# Altium project PMOD_Step.PrjPcb
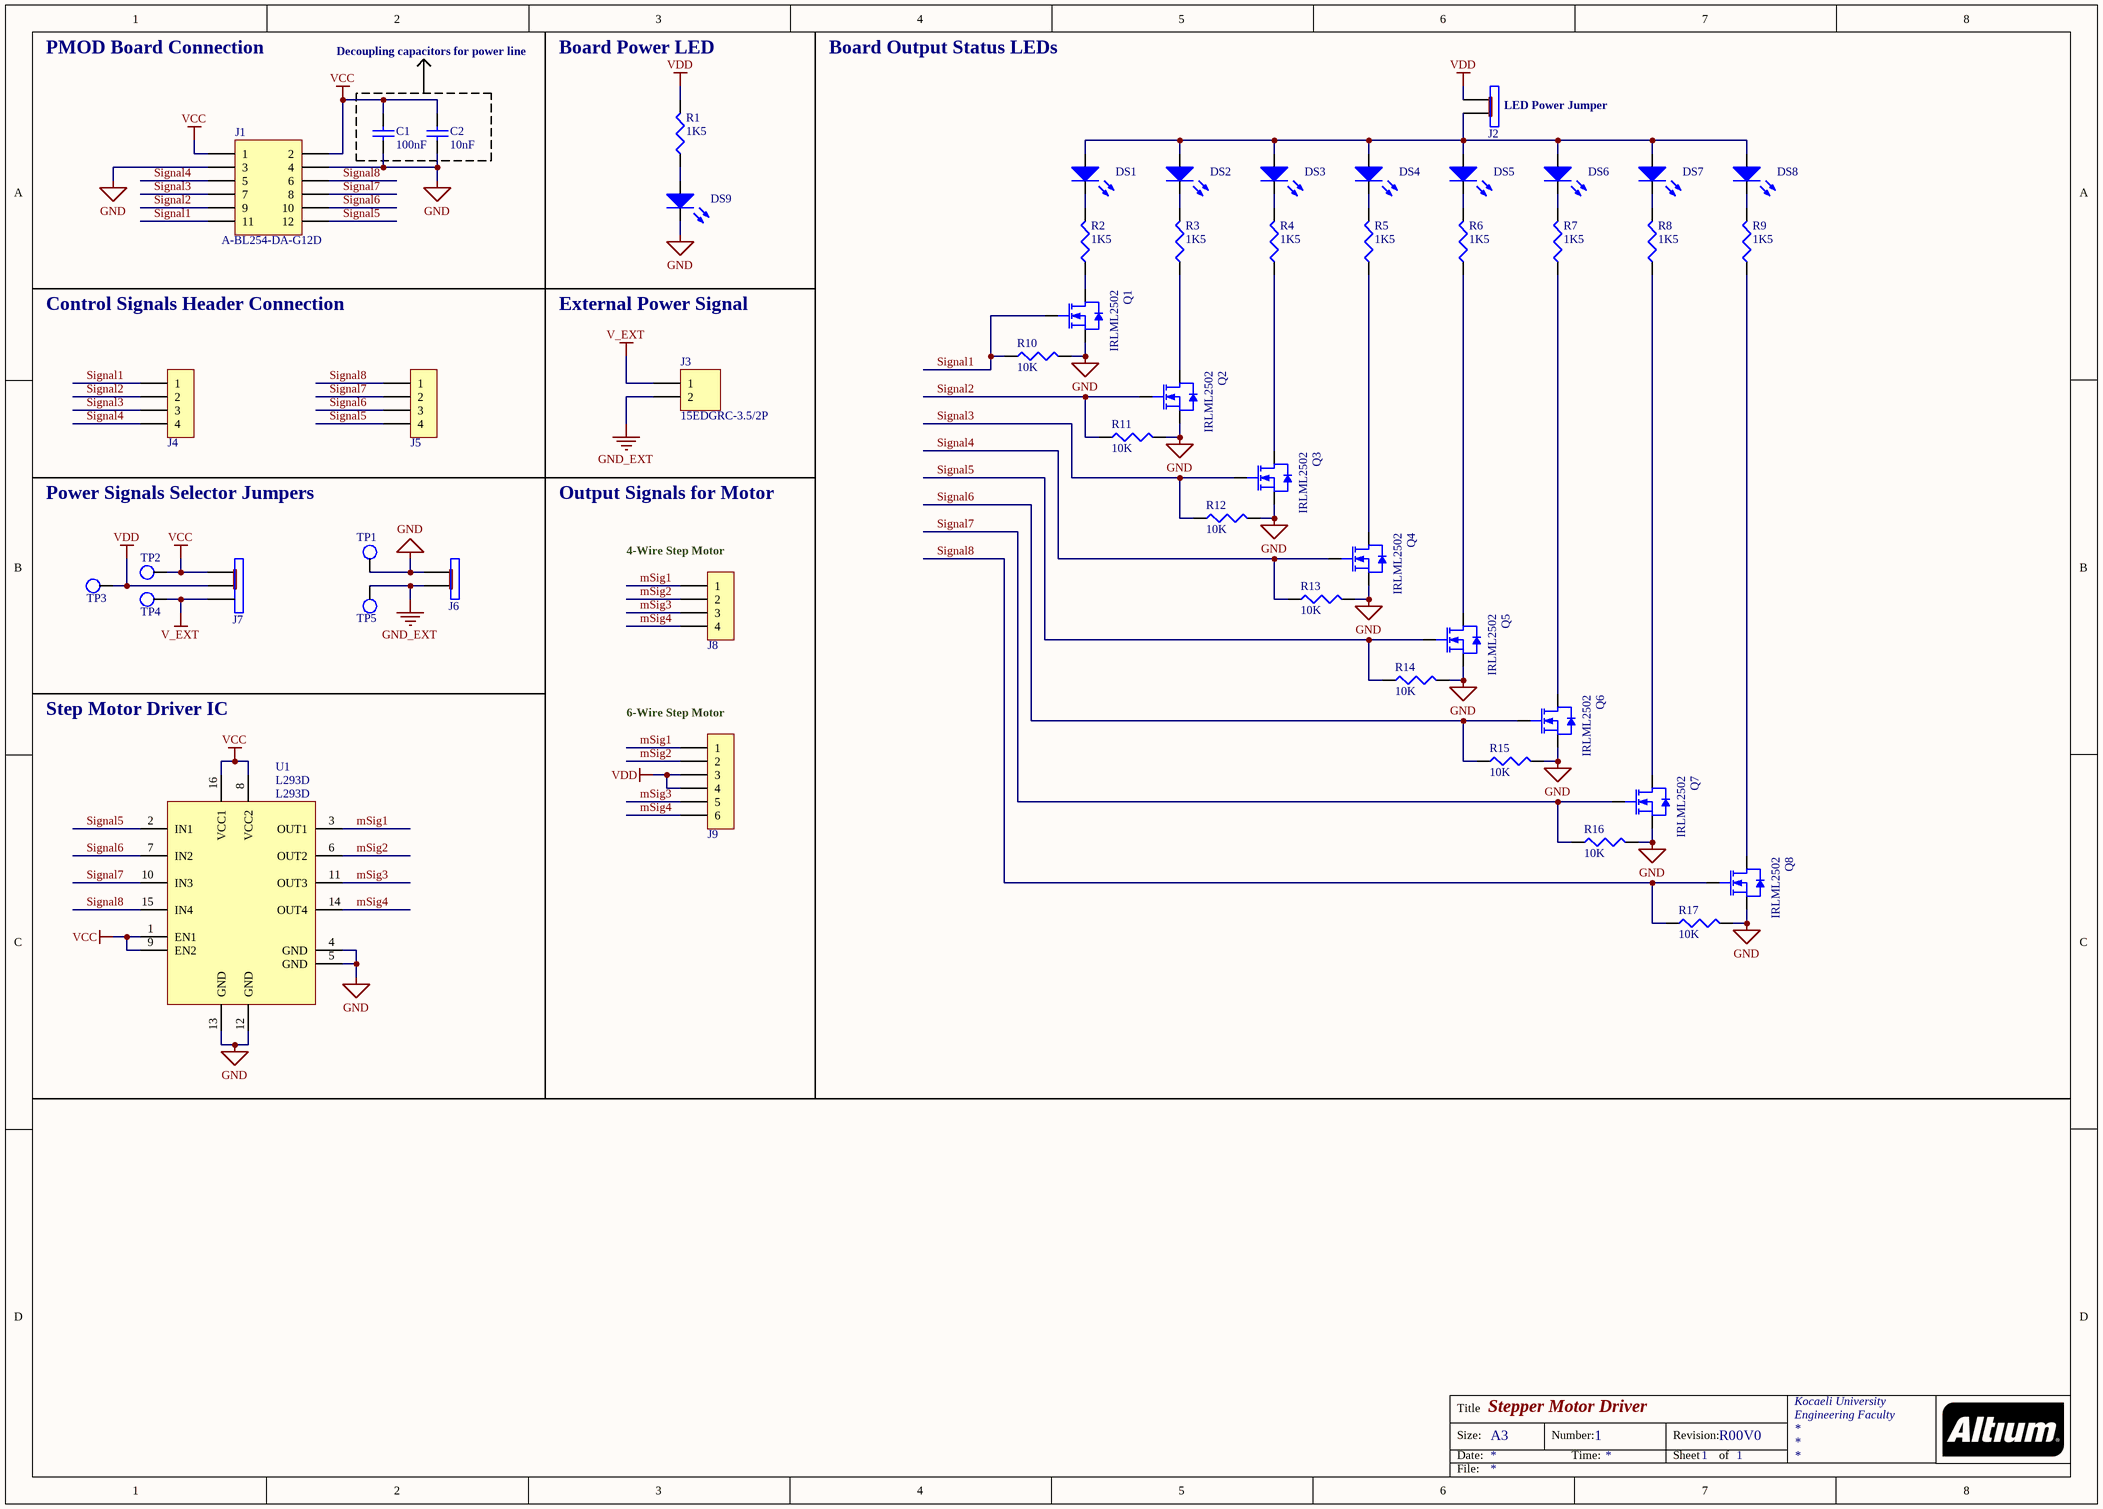
[diagram p0: [01] - Stepper Motor Driver.SchDoc]
RevNo_Sheet: R00V0; RevNo: R00V00
1 sheet, 51 parts. Net scope: global (net labels, ports and power ports of the same name join across sheets).
Board file: PMOD_Step.PcbDoc

## Sheet [01] - Stepper Motor Driver.SchDoc: Stepper Motor Driver
size A3; DrawnBy: Busra Topal; Engineer: Busra Topal; Organization: Kocaeli University; Address1: Engineering Faculty; DocumentNumber: 1; Revision: R00V0; SheetNumber: 1; SheetTotal: 1

### Parts
C1  value 100nF  [CAP-0603]  (hidden comment: CL10B104KB8NNNC)
C2  value 10nF  [CAP-0603]  (hidden comment: CL10B103KB8NNNC)
DS1  SMD Green Led  [LED_SMD_0603G]  (value not drawn)
DS2  SMD Green Led  [LED_SMD_0603G]  (value not drawn)
DS3  SMD Green Led  [LED_SMD_0603G]  (value not drawn)
DS4  SMD Green Led  [LED_SMD_0603G]  (value not drawn)
DS5  SMD Green Led  [LED_SMD_0603G]  (value not drawn)
DS6  SMD Green Led  [LED_SMD_0603G]  (value not drawn)
DS7  SMD Green Led  [LED_SMD_0603G]  (value not drawn)
DS8  SMD Green Led  [LED_SMD_0603G]  (value not drawn)
DS9  SMD Green Led  [LED_SMD_0603G]  (value not drawn)
J1  A-BL254-DA-G12D  [CON-PMOD-FEMALE-2X6]
J2  2.54mm-Jumper  [CON-JUMPER-2.54-2L]  (value not drawn)
J3  15EDGRC-3.5/2P  [15EDGRC-3.5-2]
J4  2.54mm-STD-M-1x4  [CON-HDR-M-2.54-1x4]  (value not drawn)
J5  2.54mm-STD-M-1x4  [CON-HDR-M-2.54-1x4]  (value not drawn)
J6  2.54mm-Jumper  [CON-JUMPER-2.54-2L]  (value not drawn)
J7  2.54mm-Jumper  [CON-JUMPER-2.54-3L]  (value not drawn)
J8  L-KLS1-XL5-2.50-04-R1  [CON-JST-XH-2.50-4PIN]  (value not drawn)
J9  L-KLS1-XL5-2.50-06-R1  [CON-JST-XH-2.50-6PIN]  (value not drawn)
Q1  value IRLML2502  [SOT23_L]  (hidden comment: 2N7002K)
Q2  value IRLML2502  [SOT23_L]  (hidden comment: 2N7002K)
Q3  value IRLML2502  [SOT23_L]  (hidden comment: 2N7002K)
Q4  value IRLML2502  [SOT23_L]  (hidden comment: 2N7002K)
Q5  value IRLML2502  [SOT23_L]  (hidden comment: 2N7002K)
Q6  value IRLML2502  [SOT23_L]  (hidden comment: 2N7002K)
Q7  value IRLML2502  [SOT23_L]  (hidden comment: 2N7002K)
Q8  value IRLML2502  [SOT23_L]  (hidden comment: 2N7002K)
R1  value 1K5  [RES-0603]  (hidden comment: RC0603FR-131K5L)
R2  value 1K5  [RES-0603]  (hidden comment: RC0603FR-131K5L)
R3  value 1K5  [RES-0603]  (hidden comment: RC0603FR-131K5L)
R4  value 1K5  [RES-0603]  (hidden comment: RC0603FR-131K5L)
R5  value 1K5  [RES-0603]  (hidden comment: RC0603FR-131K5L)
R6  value 1K5  [RES-0603]  (hidden comment: RC0603FR-131K5L)
R7  value 1K5  [RES-0603]  (hidden comment: RC0603FR-131K5L)
R8  value 1K5  [RES-0603]  (hidden comment: RC0603FR-131K5L)
R9  value 1K5  [RES-0603]  (hidden comment: RC0603FR-131K5L)
R10  value 10K  [RES-0603]  (hidden comment: RC0603FR-1310KL)
R11  value 10K  [RES-0603]  (hidden comment: RC0603FR-1310KL)
R12  value 10K  [RES-0603]  (hidden comment: RC0603FR-1310KL)
R13  value 10K  [RES-0603]  (hidden comment: RC0603FR-1310KL)
R14  value 10K  [RES-0603]  (hidden comment: RC0603FR-1310KL)
R15  value 10K  [RES-0603]  (hidden comment: RC0603FR-1310KL)
R16  value 10K  [RES-0603]  (hidden comment: RC0603FR-1310KL)
R17  value 10K  [RES-0603]  (hidden comment: RC0603FR-1310KL)
TP1  TP  [TP_TH]  (value not drawn)
TP2  TP  [TP_TH]  (value not drawn)
TP3  TP  [TP_TH]  (value not drawn)
TP4  TP  [TP_TH]  (value not drawn)
TP5  TP  [TP_TH]  (value not drawn)
U1  L293D  [PDIP-16]

### Nets
GND: C1.1 C2.1 DS9.2(K) J1.3 J1.4 J6.1 Q1.2(S) Q2.2(S) Q3.2(S) Q4.2(S) Q5.2(S) Q6.2(S) Q7.2(S) Q8.2(S) R10.2 R11.2 R12.2 R13.2 R14.2 R15.2 R16.2 R17.2 TP1.0 U1.4(GND) U1.5(GND) U1.12(GND) U1.13(GND)
GND_EXT: J3.2 J6.2 TP5.0
V_EXT: J3.1 J7.3 TP4.0
VCC: C1.2 C2.2 J1.1 J1.2 J7.1 TP2.0 U1.1(EN1) U1.8(VCC2) U1.9(EN2) U1.16(VCC1)
VDD: J2.1 J7.2 J9.3 J9.4 R1.2 TP3.0
mSig1: J8.1 J9.1 U1.3(OUT1)
mSig2: J8.2 J9.2 U1.6(OUT2)
mSig3: J8.3 J9.5 U1.11(OUT3)
mSig4: J8.4 J9.6 U1.14(OUT4)
Signal1: J1.11 J4.1 Q1.1(G) R10.1
Signal2: J1.9 J4.2 Q2.1(G) R11.1
Signal3: J1.7 J4.3 Q3.1(G) R12.1
Signal4: J1.5 J4.4 Q4.1(G) R13.1
Signal5: J1.12 J5.4 Q5.1(G) R14.1 U1.2(IN1)
Signal6: J1.10 J5.3 Q6.1(G) R15.1 U1.7(IN2)
Signal7: J1.8 J5.2 Q7.1(G) R16.1 U1.10(IN3)
Signal8: J1.6 J5.1 Q8.1(G) R17.1 U1.15(IN4)
NetDS1_1: DS1.1(A) DS2.1(A) DS3.1(A) DS4.1(A) DS5.1(A) DS6.1(A) DS7.1(A) DS8.1(A) J2.2
NetDS1_2: DS1.2(K) R2.2
NetDS2_2: DS2.2(K) R3.2
NetDS3_2: DS3.2(K) R4.2
NetDS4_2: DS4.2(K) R5.2
NetDS5_2: DS5.2(K) R6.2
NetDS6_2: DS6.2(K) R7.2
NetDS7_2: DS7.2(K) R8.2
NetDS8_2: DS8.2(K) R9.2
NetDS9_1: DS9.1(A) R1.1
NetQ1_3: Q1.3(D) R2.1
NetQ2_3: Q2.3(D) R3.1
NetQ3_3: Q3.3(D) R4.1
NetQ4_3: Q4.3(D) R5.1
NetQ5_3: Q5.3(D) R6.1
NetQ6_3: Q6.3(D) R7.1
NetQ7_3: Q7.3(D) R8.1
NetQ8_3: Q8.3(D) R9.1

### Notes on the sheet
- PMOD Board Connection
- Decoupling capacitors for power line
- Board Power LED
- Board Output Status LEDs
- (near J2) LED Power Jumper
- Control Signals Header Connection
- External Power Signal
- Power Signals Selector Jumpers
- Output Signals for Motor
- (near J8) 4-Wire Step Motor
- Step Motor Driver IC
- (near J9) 6-Wire Step Motor
- Title
- Size:
- Date:
- A3
- Number:
- Time:
- Revision:
- Sheet
- of
- File:

### Library data of the parts
C1 = CAP-100N-0603: CAP CER 0.1UF 50V 10% X7R 0603; Manufacturer: Samsung Electro-Mechanics America, Inc; Capacitance: 0.1µF; Supplier 1: Digi-Key; Manufacturer Part Number: CL10B104KB8NNNC; RoHS: RoHS Compliant; Category: Capacitors; Stock 1: 9364000; Pricing 1: 4000=0.00513, 8000=0.00468, 12000=0.00446, 28000=0.00424, 100000=0.00307 (USD); Packaging: Tape & Reel (TR); Tolerance: ±10%; Voltage - Rated: 50V; Temperature Coefficient: X7R; Mounting Type: Surface Mount, MLCC; Operating Temperature: -55°C ~ 125°C; Applications: General Purpose; Ratings: -; Package / Case: 0603 (1608 Metric); Size / Dimension: 0.063" L x 0.031" W (1.60mm x 0.80mm); Height - Seated (Max): -; Thickness (Max): 0.035" (0.90mm); Lead Spacing: -; Features: -; Lead Style: -; ComponentLink1URL: http://www.samsungsem.com/servlet/FileDownload?type=spec&file=CL10B104KB8NNNC.pdf; ComponentLink1Description: http://www.samsungsem.com/servlet/FileDownload?type=spec&file=CL10B104KB8NNNC.pdf; Supplier Part Number 1: 1276-1000-2-ND
C2 = CAP-10N-0603: CAP CER 10000PF 50V 10% X7R 0603; Manufacturer: Samsung Electro-Mechanics America, Inc; Supplier 1: Digi-Key; Manufacturer Part Number: CL10B103KB8NNNC; RoHS: RoHS Compliant; Category: Capacitors; Stock 1: 504000; Pricing 1: 4000=0.00345, 8000=0.00315, 12000=0.003, 28000=0.00285, 100000=0.00206 (USD); Packaging: Tape & Reel (TR); Capacitance: 10000pF; Tolerance: ±10%; Voltage - Rated: 50V; Temperature Coefficient: X7R; Mounting Type: Surface Mount, MLCC; Operating Temperature: -55°C ~ 125°C; Applications: General Purpose; Ratings: -; Package / Case: 0603 (1608 Metric); Size / Dimension: 0.063" L x 0.031" W (1.60mm x 0.80mm); Height - Seated (Max): -; Thickness (Max): 0.035" (0.90mm); Lead Spacing: -; Features: -; Lead Style: -; ComponentLink1URL: http://www.samsungsem.com/servlet/FileDownload?type=spec&file=CL10B103KB8NNNC.pdf; ComponentLink1Description: http://www.samsungsem.com/servlet/FileDownload?type=spec&file=CL10B103KB8NNNC.pdf; Supplier Part Number 1: 1276-1009-2-ND
DS1-DS9 = LED-SMD-GRN: LED GREEN CLEAR 0603 SMD; Manufacturer: Lite-On Inc.; Manufacturer Part Number: LTST-C193KGKT-5A; Lens Color: Colorless; Millicandela Rating: 16.25mcd; Lens Style/Size: Rectangle with Flat Top, 1.15mm x 0.80mm; Voltage - Forward (Vf) (Typ): 2V; Current - Test: 5mA; Viewing Angle: 130°; Wavelength - Dominant: 572nm; Wavelength - Peak: 574nm; Value: LTST-C193KGKT-5A; Supplier 1: Digi-Key; RoHS: RoHS Compliant; Category: Optoelectronics; Stock 1: 108152; Pricing 1: 1=0.41, 10=0.296, 25=0.2268, 100=0.148, 250=0.10852, 500=0.0921, 1000=0.07565 (USD); Packaging: Cut Tape (CT); Part Status: Active; Color: Green; Lens Transparency: Clear; Mounting Type: Surface Mount; Features: -; Package / Case: 0603 (1608 Metric); Supplier Device Package: *; Size / Dimension: 1.60mm L x 0.80mm W; Height (Max): 0.35mm; ComponentLink1URL: http://optoelectronics.liteon.com/upload/download/DS22-2007-0094/S_110_LTST-C193KGKT-5A.pdf; ComponentLink1Description: http://optoelectronics.liteon.com/upload/download/DS22-2007-0094/S_110_LTST-C193KGKT-5A.pdf; Supplier Part Number 1: 160-1828-1-ND
J1 = CON-PMOD-FEMALE-2X6: 2.54mm Standart Female PMOD Connector 2x6; Manufacturer: ASSMANN; Number of Positions: 2; Number of Levels: 1; Pitch: 0.049" (1.25mm); Header Orientation: Vertical; Manufacturer Part Number: A-BL254-DA-G12D; RoHS: RoHS Compliant; Category: Connectors, Interconnects; Packaging: Bulk; Part Status: Active; Type: Header, Male Pins, Shrouded; Positions Per Level: 2; Termination Style: Solder; Mounting Type: Through Hole; Color: White; Operating Temperature: -40°C ~ 115°C; ComponentLink1URL: https://www.cvilux.com/uploads/spec/100/483/SPCI028.pdf; ComponentLink1Description: https://www.cvilux.com/uploads/spec/100/483/SPCI028.pdf; Value: A-BL254-DA-G12D
J2 J6 = CON-JUMPER-2.54-2L: 2.54mm Male Straight 1x2 standard Header; Manufacturer: KLS; Number of Positions: 2; Number of Levels: 1; Header Orientation: Vertical; Manufacturer Part Number: 2.54mm-Jumper; RoHS: RoHS Compliant; Category: Connectors, Interconnects; Packaging: Bulk; Part Status: Active; Type: Header, Male Pins, Shrouded; Positions Per Level: 2; Pitch: 2.54mm; Termination Style: Solder; Mounting Type: Through Hole; Color: White; Operating Temperature: -40°C ~ 115°C; ComponentLink1URL: https://www.cvilux.com/uploads/spec/100/483/SPCI028.pdf; ComponentLink1Description: https://www.cvilux.com/uploads/spec/100/483/SPCI028.pdf; Value: 2.54mm-Jumper
J3 = 15EDGRC-3.5-02P: Pluggable terminal block; socket; male; angled 90°; 3.5mm; ways:2; Manufacturer: DEGSON ELECTRONICS; Unit: pcs; SuppliedAmount: 2000; MinAmount: 2; Multiples: 1; Rated current: 7A; Electrical mounting: THT; Supplier 1: TME; Manufacturer Part Number: 15EDGRC-3.5/2P; Category: Terminal blocks PCB mount; Stock 1: 0; Pricing 1: 2=0,327, 25=0,165, 100=0,124, 500=0,116, 2000=0,101 (USD); Weight: 0,472; Price Type: NET; Connector type: pluggable terminal block; Connector: socket; Spatial orientation: angled 90°; Contacts pitch: 3.5mm; Number of ways: 2; ComponentLink1URL: http://www.tme.eu/en/details/15edgrc-3.5_2p/terminal-blocks-pcb-mount/degson-electronics/; ComponentLink1Description: http://www.tme.eu/en/details/15edgrc-3.5_2p/terminal-blocks-pcb-mount/degson-electronics/; Supplier Part Number 1: 15EDGRC-3.5/2P; Value: 15EDGRC-3.5/2P
J4 J5 = CON-HDR-M-2.54-1x4: 2.54mm Male Straight 1x2 standard Header; Manufacturer: KLS; Number of Positions: 4; Number of Levels: 1; Header Orientation: Vertical; Manufacturer Part Number: 2.54mm-STD-M-1x4; RoHS: RoHS Compliant; Category: Connectors, Interconnects; Packaging: Bulk; Part Status: Active; Type: Header, Male Pins, Shrouded; Positions Per Level: 4; Pitch: 2.54mm; Termination Style: Solder; Mounting Type: Through Hole; Color: White; Operating Temperature: -40°C ~ 115°C; ComponentLink1URL: https://www.cvilux.com/uploads/spec/100/483/SPCI028.pdf; ComponentLink1Description: https://www.cvilux.com/uploads/spec/100/483/SPCI028.pdf; Value: 2.54mm-STD-M-1x4
J7 = CON-JUMPER-2.54-3L: 2.54mm Male Straight 1x2 standard Header; Manufacturer: KLS; Number of Positions: 3; Number of Levels: 1; Header Orientation: Vertical; Manufacturer Part Number: 2.54mm-Jumper; RoHS: RoHS Compliant; Category: Connectors, Interconnects; Packaging: Bulk; Part Status: Active; Type: Header, Male Pins, Shrouded; Positions Per Level: 3; Pitch: 2.54mm; Termination Style: Solder; Mounting Type: Through Hole; Color: White; Operating Temperature: -40°C ~ 115°C; ComponentLink1URL: https://www.cvilux.com/uploads/spec/100/483/SPCI028.pdf; ComponentLink1Description: https://www.cvilux.com/uploads/spec/100/483/SPCI028.pdf; Value: 2.54mm-Jumper
J8 = CON-JST-XH-4PIN: 2.50mm JST-XH 4 Pin Male Connector; Manufacturer: KLS Electronics; Number of Positions: 4; Number of Levels: 1; Header Orientation: Vertical; Manufacturer Part Number: L-KLS1-XL5-2.50-04-R1; RoHS: RoHS Compliant; Category: Connectors, Interconnects; Packaging: Bulk; Part Status: Active; Type: Header, Male Pins, Shrouded; Positions Per Level: 4; Pitch: 2.50mm; Termination Style: Solder; Mounting Type: Through Hole; Color: White; Operating Temperature: -40°C ~ 115°C; ComponentLink1URL: https://www.cvilux.com/uploads/spec/100/483/SPCI028.pdf; ComponentLink1Description: https://www.cvilux.com/uploads/spec/100/483/SPCI028.pdf; Value: L-KLS1-XL5-2.50-04-R1
J9 = CON-JST-XH-6PIN: 2.50mm JST-XH 6 Pin Male Connector; Manufacturer: KLS Electronics; Number of Positions: 6; Number of Levels: 1; Header Orientation: Vertical; Manufacturer Part Number: L-KLS1-XL5-2.50-06-R1; RoHS: RoHS Compliant; Category: Connectors, Interconnects; Packaging: Bulk; Part Status: Active; Type: Header, Male Pins, Shrouded; Positions Per Level: 6; Pitch: 2.50mm; Termination Style: Solder; Mounting Type: Through Hole; Color: White; Operating Temperature: -40°C ~ 115°C; ComponentLink1URL: https://www.cvilux.com/uploads/spec/100/483/SPCI028.pdf; ComponentLink1Description: https://www.cvilux.com/uploads/spec/100/483/SPCI028.pdf; Value: L-KLS1-XL5-2.50-06-R1
Q1-Q8 = TRQ-IRLML2502: MOSFET N-CH 20V 4.2A SOT23; Manufacturer: Infineon Technologies; FET Type: MOSFET N-Channel, Metal Oxide; FET Feature: Logic Level Gate; Current - Continuous Drain (Id) @ 25°C: 4.2A (Ta); Rds On (Max) @ Id, Vgs: 45mOhm @ 4.2A, 4.5V; Vgs(th) (Max) @ Id: 1.2V @ 250µA; Gate Charge (Qg) @ Vgs: 12 nC @ 5 V; Input Capacitance (Ciss) @ Vds: 50pF @ 25V; Power - Max: 350mW; RoHS: RoHS Compliant; Category: Discrete Semiconductor Products; Stock 1: 36000; Pricing 1: 3000=0.046, 6000=0.04, 15000=0.034, 30000=0.032, 75000=0.03, 150000=0.026 (USD); Packaging: Tape & Reel (TR); Drain to Source Voltage (Vdss): 20 V; Mounting Type: Surface Mount; Package / Case: TO-236-3, SC-59, SOT-23-3; Supplier Device Package: SOT-23; ComponentLink1URL: http://www.fairchildsemi.com/ds/2N/2N7002K.pdf; ComponentLink1Description: http://www.fairchildsemi.com/ds/2N/2N7002K.pdf; Manufacturer Part Number: 2N7002K; Supplier 1: Farnell; Supplier Part Number 1: 9102981
R1-R9 = RES-1K5-0603: RES 1.5K OHM 1% 1/10W 0603; Manufacturer: YAGEO; Resistance (Ohms): 1.5 kOhms; Power (Watts): 0.1W, 1/10W; Temperature Coefficient: ±200ppm/°C; Manufacturer Part Number: RC0603FR-131K5L; RoHS: -; Category: Resistors; Stock 1: 151894; Pricing 1: 1=0.23, 10=0.194, 25=0.1408, 50=0.102, 100=0.0757, 250=0.05808, 500=0.04576, 1000=0.03168, 2500=0.02904 (USD); Packaging: Cut Tape (CT); Part Status: Active; Tolerance: ±1%; Composition: Thick Film; Features: Automotive AEC-Q200; Operating Temperature: -55°C ~ 155°C; Package / Case: 0603 (1608 Metric); Supplier Device Package: 0603; Size / Dimension: 0.063" L x 0.031" W (1.60mm x 0.80mm); Height - Seated (Max): 0.022" (0.55mm); Number of Terminations: 2; Failure Rate: -; ComponentLink1URL: http://www.vishay.com/docs/20043/crcwhpe3.pdf; ComponentLink1Description: http://www.vishay.com/docs/20043/crcwhpe3.pdf; Supplier 1: Avnet; Supplier Part Number 1: RC0603FR-131K5L
R10-R17 = RES-10K-0603: RES 10K OHM 1% 1/10W 0603; Manufacturer: YAGEO; Resistance (Ohms): 10 kOhms; Power (Watts): 0.1W, 1/10W; Temperature Coefficient: ±100ppm/°C; Manufacturer Part Number: RC0603FR-1310KL; RoHS: -; Category: Resistors; Stock 1: 151894; Pricing 1: 1=0.23, 10=0.194, 25=0.1408, 50=0.102, 100=0.0757, 250=0.05808, 500=0.04576, 1000=0.03168, 2500=0.02904 (USD); Packaging: Cut Tape (CT); Part Status: Active; Tolerance: ±1%; Composition: Thick Film; Features: -; Operating Temperature: -55°C ~ 155°C; Package / Case: 0603 (1608 Metric); Supplier Device Package: 0603; Size / Dimension: 0.063" L x 0.031" W (1.60mm x 0.80mm); Height - Seated (Max): 0.022" (0.55mm); Number of Terminations: 2; Failure Rate: -; ComponentLink1URL: http://www.vishay.com/docs/20043/crcwhpe3.pdf; ComponentLink1Description: http://www.vishay.com/docs/20043/crcwhpe3.pdf; Supplier 1: Future Electronics; Supplier Part Number 1: 4510020
TP1-TP5 = TP: Test Point; Published: 25-Oct-2009; Publisher: tmk; ClassName: Test Points
U1 = IC-L293D-PDIP: IC MTR DRV BIPOLR 4.5-36V 20SOIC; Supplier 1: Mouser; Supplier Part Number 1: 511-L293D; Value: L293D

## Assembly variants
PMOD_Step: not fitted TP1 TP2 TP3 TP4 TP5